# EAGLE schematic V4-AddOnZigbee-SMD-V006 (EAGLE 9.3.0)
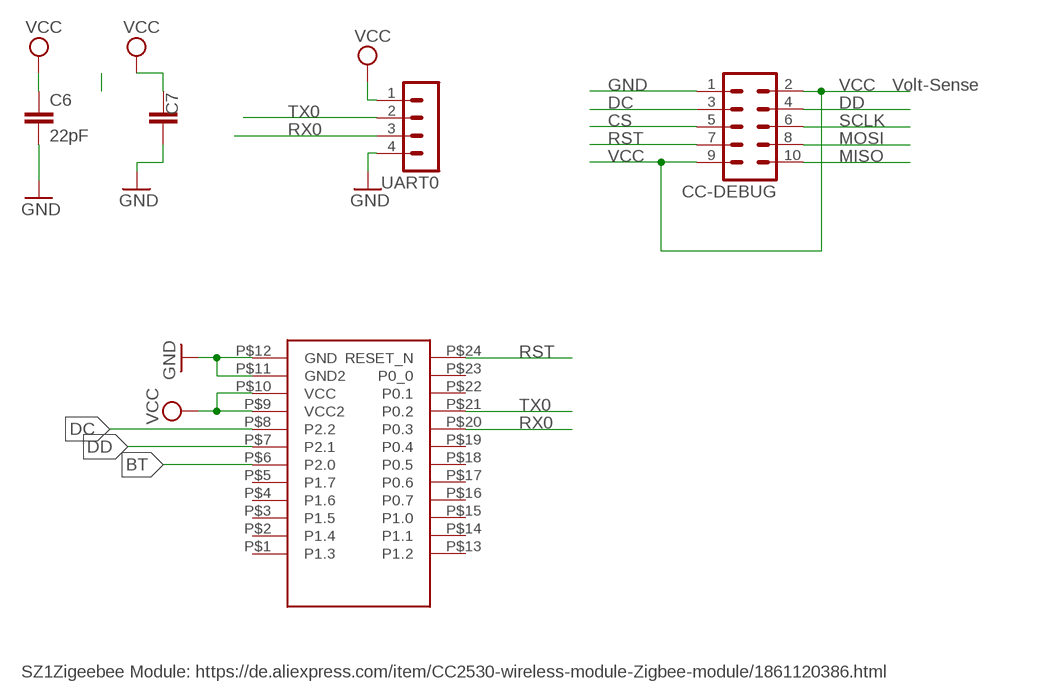
[diagram p0: schematic, sheet 1]

## Parts
C6  22pF  C-EUC0805  [C0805]
C7  C-EUC1812  [C1812]
CC-DEBUG  MA05-2  [MA05-2]
U$1  CC2530  [SZ1ZIGBEE-SMD]
UART0  MA04-1  [MA04-1]

## Nets
BT: U$1.P$6(P2.0)
CS: CC-DEBUG.5
DC: CC-DEBUG.3 U$1.P$8(P2.2)
DD: CC-DEBUG.4 U$1.P$7(P2.1)
GND [PWR]: C6.2 C7.1 CC-DEBUG.1 U$1.P$11(GND2) U$1.P$12(GND) UART0.4
MISO: CC-DEBUG.10
MOSI: CC-DEBUG.8
RST: CC-DEBUG.7 U$1.P$24(RESET_N)
RX0: U$1.P$20(P0.3) UART0.3
SCLK: CC-DEBUG.6
TX0: U$1.P$21(P0.2) UART0.2
VCC [PWR]: C6.1 C7.2 CC-DEBUG.2 CC-DEBUG.9 U$1.P$9(VCC2) U$1.P$10(VCC) UART0.1
Unconnected: U$1.P$1(P1.3) U$1.P$2(P1.4) U$1.P$3(P1.5) U$1.P$4(P1.6) U$1.P$5(P1.7) U$1.P$13(P1.2) U$1.P$14(P1.1) U$1.P$15(P1.0) U$1.P$16(P0.7) U$1.P$17(P0.6) U$1.P$18(P0.5) U$1.P$19(P0.4) U$1.P$22(P0.1) U$1.P$23(P0_0)

## Notes on the sheet
- Volt-Sense
- SZ1Zigeebee Module: https://de.aliexpress.com/item/CC2530-wireless-module-Zigbee-module/1861120386.html

## Library data of the parts
C6 C7 = rcl:C-EU: CAPACITOR, European symbol; SPICEPREFIX: C
CC-DEBUG = con-lstb:MA05-2: PIN HEADER; OC_FARNELL: unknown; OC_NEWARK: unknown
U$1 = zigbee:CC2530: CC2530 Wireless Zigbee Module 3.0-3.6V 2.405-2.485GHz SMD Pads !
UART0 = con-lstb:MA04-1: PIN HEADER; OC_FARNELL: unknown; OC_NEWARK: unknown

## Net classes
0 default: width 0.305 mm
1 PWR: width 0.61 mm